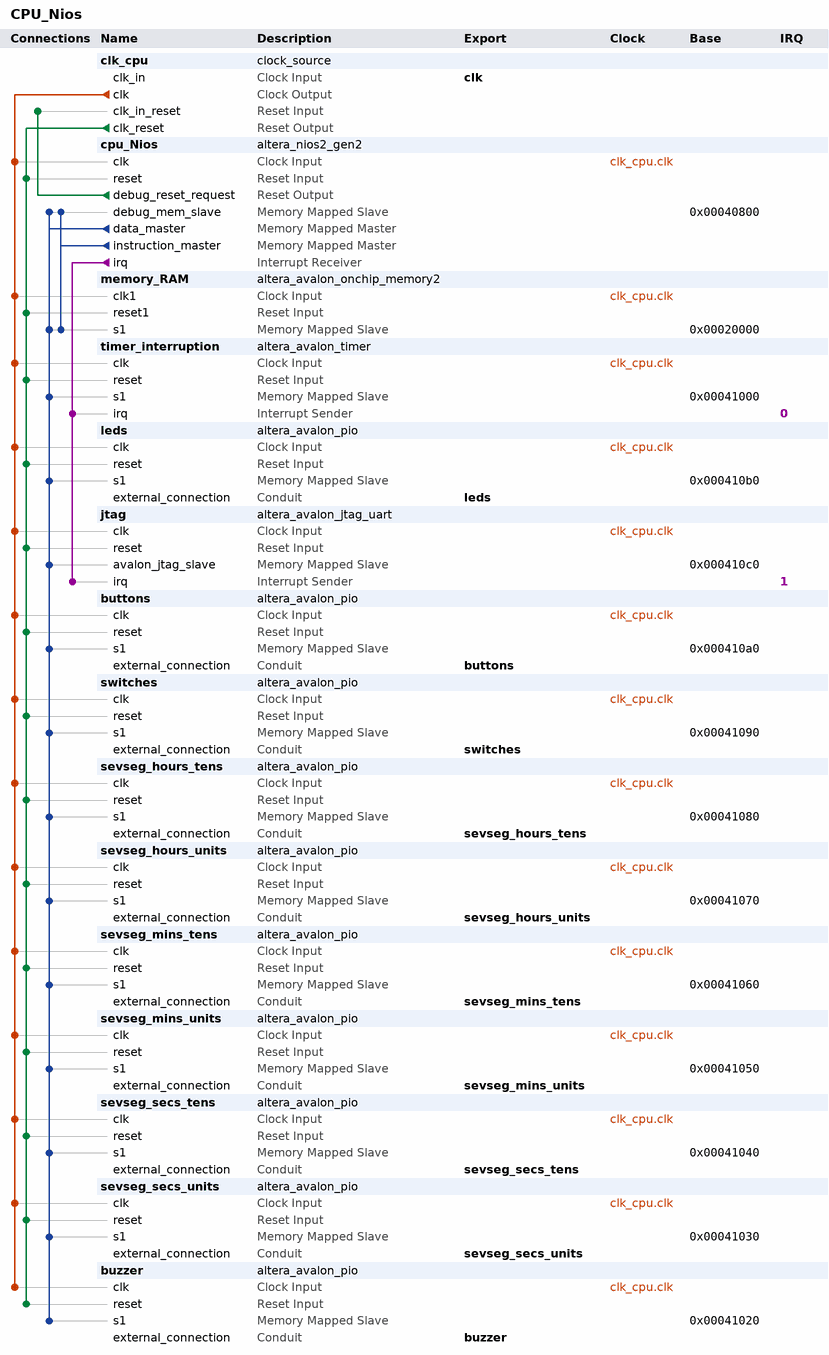
[diagram p0: system contents]
# Platform Designer (Qsys) system CPU_Nios, Cyclone V 5CSEMA5F31C6
# Parameters at their usual value, and those the tool derives, are not listed.
package require -exact qsys 22.1
create_system CPU_Nios
set_project_property DEVICE_FAMILY {Cyclone V}
set_project_property DEVICE 5CSEMA5F31C6

add_instance clk_cpu clock_source 22.1
set_instance_parameter_value clk_cpu clockFrequency 50000000

add_instance cpu_Nios altera_nios2_gen2 22.1
set_instance_parameter_value cpu_Nios dcache_size 2048
set_instance_parameter_value cpu_Nios exceptionSlave memory_RAM.s1
set_instance_parameter_value cpu_Nios icache_size 4096
set_instance_parameter_value cpu_Nios impl Tiny
set_instance_parameter_value cpu_Nios resetSlave memory_RAM.s1

add_instance memory_RAM altera_avalon_onchip_memory2 22.1
set_instance_parameter_value memory_RAM dataWidth 32
set_instance_parameter_value memory_RAM dualPort false
set_instance_parameter_value memory_RAM initMemContent true
set_instance_parameter_value memory_RAM initializationFileName onchip_mem.hex
set_instance_parameter_value memory_RAM memorySize 131072

add_instance timer_interruption altera_avalon_timer 22.1
set_instance_parameter_value timer_interruption period 1000
set_instance_parameter_value timer_interruption periodUnits MSEC

add_instance leds altera_avalon_pio 22.1
set_instance_parameter_value leds direction Output
set_instance_parameter_value leds width 10

add_instance jtag altera_avalon_jtag_uart 22.1
set_instance_parameter_value jtag simInteractiveOptions NO_INTERACTIVE_WINDOWS

add_instance buttons altera_avalon_pio 22.1
set_instance_parameter_value buttons direction Input
set_instance_parameter_value buttons width 4

add_instance switches altera_avalon_pio 22.1
set_instance_parameter_value switches direction Input
set_instance_parameter_value switches width 2

add_instance sevseg_hours_tens altera_avalon_pio 22.1
set_instance_parameter_value sevseg_hours_tens direction Output
set_instance_parameter_value sevseg_hours_tens resetValue 127
set_instance_parameter_value sevseg_hours_tens width 7

add_instance sevseg_hours_units altera_avalon_pio 22.1
set_instance_parameter_value sevseg_hours_units direction Output
set_instance_parameter_value sevseg_hours_units resetValue 127
set_instance_parameter_value sevseg_hours_units width 7

add_instance sevseg_mins_tens altera_avalon_pio 22.1
set_instance_parameter_value sevseg_mins_tens direction Output
set_instance_parameter_value sevseg_mins_tens resetValue 127
set_instance_parameter_value sevseg_mins_tens width 7

add_instance sevseg_mins_units altera_avalon_pio 22.1
set_instance_parameter_value sevseg_mins_units direction Output
set_instance_parameter_value sevseg_mins_units resetValue 127
set_instance_parameter_value sevseg_mins_units width 7

add_instance sevseg_secs_tens altera_avalon_pio 22.1
set_instance_parameter_value sevseg_secs_tens direction Output
set_instance_parameter_value sevseg_secs_tens resetValue 127
set_instance_parameter_value sevseg_secs_tens width 7

add_instance sevseg_secs_units altera_avalon_pio 22.1
set_instance_parameter_value sevseg_secs_units direction Output
set_instance_parameter_value sevseg_secs_units resetValue 127
set_instance_parameter_value sevseg_secs_units width 7

add_instance buzzer altera_avalon_pio 22.1
set_instance_parameter_value buzzer direction Output
set_instance_parameter_value buzzer width 1

# connections
add_connection clk_cpu.clk buttons.clk clock
add_connection clk_cpu.clk buzzer.clk clock
add_connection clk_cpu.clk cpu_Nios.clk clock
add_connection clk_cpu.clk jtag.clk clock
add_connection clk_cpu.clk leds.clk clock
add_connection clk_cpu.clk memory_RAM.clk1 clock
add_connection clk_cpu.clk sevseg_hours_tens.clk clock
add_connection clk_cpu.clk sevseg_hours_units.clk clock
add_connection clk_cpu.clk sevseg_mins_tens.clk clock
add_connection clk_cpu.clk sevseg_mins_units.clk clock
add_connection clk_cpu.clk sevseg_secs_tens.clk clock
add_connection clk_cpu.clk sevseg_secs_units.clk clock
add_connection clk_cpu.clk switches.clk clock
add_connection clk_cpu.clk timer_interruption.clk clock
add_connection clk_cpu.clk_reset buttons.reset reset
add_connection clk_cpu.clk_reset buzzer.reset reset
add_connection clk_cpu.clk_reset cpu_Nios.reset reset
add_connection clk_cpu.clk_reset jtag.reset reset
add_connection clk_cpu.clk_reset leds.reset reset
add_connection clk_cpu.clk_reset memory_RAM.reset1 reset
add_connection clk_cpu.clk_reset sevseg_hours_tens.reset reset
add_connection clk_cpu.clk_reset sevseg_hours_units.reset reset
add_connection clk_cpu.clk_reset sevseg_mins_tens.reset reset
add_connection clk_cpu.clk_reset sevseg_mins_units.reset reset
add_connection clk_cpu.clk_reset sevseg_secs_tens.reset reset
add_connection clk_cpu.clk_reset sevseg_secs_units.reset reset
add_connection clk_cpu.clk_reset switches.reset reset
add_connection clk_cpu.clk_reset timer_interruption.reset reset
add_connection cpu_Nios.debug_reset_request clk_cpu.clk_in_reset reset
add_connection cpu_Nios.data_master buttons.s1 avalon
set_connection_parameter_value cpu_Nios.data_master/buttons.s1 baseAddress 0x000410a0
add_connection cpu_Nios.data_master buzzer.s1 avalon
set_connection_parameter_value cpu_Nios.data_master/buzzer.s1 baseAddress 0x00041020
add_connection cpu_Nios.data_master cpu_Nios.debug_mem_slave avalon
set_connection_parameter_value cpu_Nios.data_master/cpu_Nios.debug_mem_slave baseAddress 0x00040800
add_connection cpu_Nios.data_master jtag.avalon_jtag_slave avalon
set_connection_parameter_value cpu_Nios.data_master/jtag.avalon_jtag_slave baseAddress 0x000410c0
add_connection cpu_Nios.data_master leds.s1 avalon
set_connection_parameter_value cpu_Nios.data_master/leds.s1 baseAddress 0x000410b0
add_connection cpu_Nios.data_master memory_RAM.s1 avalon
set_connection_parameter_value cpu_Nios.data_master/memory_RAM.s1 baseAddress 0x00020000
add_connection cpu_Nios.data_master sevseg_hours_tens.s1 avalon
set_connection_parameter_value cpu_Nios.data_master/sevseg_hours_tens.s1 baseAddress 0x00041080
add_connection cpu_Nios.data_master sevseg_hours_units.s1 avalon
set_connection_parameter_value cpu_Nios.data_master/sevseg_hours_units.s1 baseAddress 0x00041070
add_connection cpu_Nios.data_master sevseg_mins_tens.s1 avalon
set_connection_parameter_value cpu_Nios.data_master/sevseg_mins_tens.s1 baseAddress 0x00041060
add_connection cpu_Nios.data_master sevseg_mins_units.s1 avalon
set_connection_parameter_value cpu_Nios.data_master/sevseg_mins_units.s1 baseAddress 0x00041050
add_connection cpu_Nios.data_master sevseg_secs_tens.s1 avalon
set_connection_parameter_value cpu_Nios.data_master/sevseg_secs_tens.s1 baseAddress 0x00041040
add_connection cpu_Nios.data_master sevseg_secs_units.s1 avalon
set_connection_parameter_value cpu_Nios.data_master/sevseg_secs_units.s1 baseAddress 0x00041030
add_connection cpu_Nios.data_master switches.s1 avalon
set_connection_parameter_value cpu_Nios.data_master/switches.s1 baseAddress 0x00041090
add_connection cpu_Nios.data_master timer_interruption.s1 avalon
set_connection_parameter_value cpu_Nios.data_master/timer_interruption.s1 baseAddress 0x00041000
add_connection cpu_Nios.instruction_master cpu_Nios.debug_mem_slave avalon
set_connection_parameter_value cpu_Nios.instruction_master/cpu_Nios.debug_mem_slave baseAddress 0x00040800
add_connection cpu_Nios.instruction_master memory_RAM.s1 avalon
set_connection_parameter_value cpu_Nios.instruction_master/memory_RAM.s1 baseAddress 0x00020000
add_connection cpu_Nios.irq jtag.irq interrupt
set_connection_parameter_value cpu_Nios.irq/jtag.irq irqNumber 1
add_connection cpu_Nios.irq timer_interruption.irq interrupt
set_connection_parameter_value cpu_Nios.irq/timer_interruption.irq irqNumber 0

# exported interfaces
add_interface buttons conduit end
set_interface_property buttons EXPORT_OF buttons.external_connection
add_interface buzzer conduit end
set_interface_property buzzer EXPORT_OF buzzer.external_connection
add_interface clk clock sink
set_interface_property clk EXPORT_OF clk_cpu.clk_in
add_interface leds conduit end
set_interface_property leds EXPORT_OF leds.external_connection
add_interface sevseg_hours_tens conduit end
set_interface_property sevseg_hours_tens EXPORT_OF sevseg_hours_tens.external_connection
add_interface sevseg_hours_units conduit end
set_interface_property sevseg_hours_units EXPORT_OF sevseg_hours_units.external_connection
add_interface sevseg_mins_tens conduit end
set_interface_property sevseg_mins_tens EXPORT_OF sevseg_mins_tens.external_connection
add_interface sevseg_mins_units conduit end
set_interface_property sevseg_mins_units EXPORT_OF sevseg_mins_units.external_connection
add_interface sevseg_secs_tens conduit end
set_interface_property sevseg_secs_tens EXPORT_OF sevseg_secs_tens.external_connection
add_interface sevseg_secs_units conduit end
set_interface_property sevseg_secs_units EXPORT_OF sevseg_secs_units.external_connection
add_interface switches conduit end
set_interface_property switches EXPORT_OF switches.external_connection

set_interconnect_requirement {$system} qsys_mm.clockCrossingAdapter HANDSHAKE
set_interconnect_requirement {$system} qsys_mm.enableEccProtection FALSE
set_interconnect_requirement {$system} qsys_mm.insertDefaultSlave FALSE
set_interconnect_requirement {$system} qsys_mm.maxAdditionalLatency 1

save_system CPU_Nios.qsys
